# EAGLE board memory_mkII (EAGLE 9.5.2), part 1 of 2
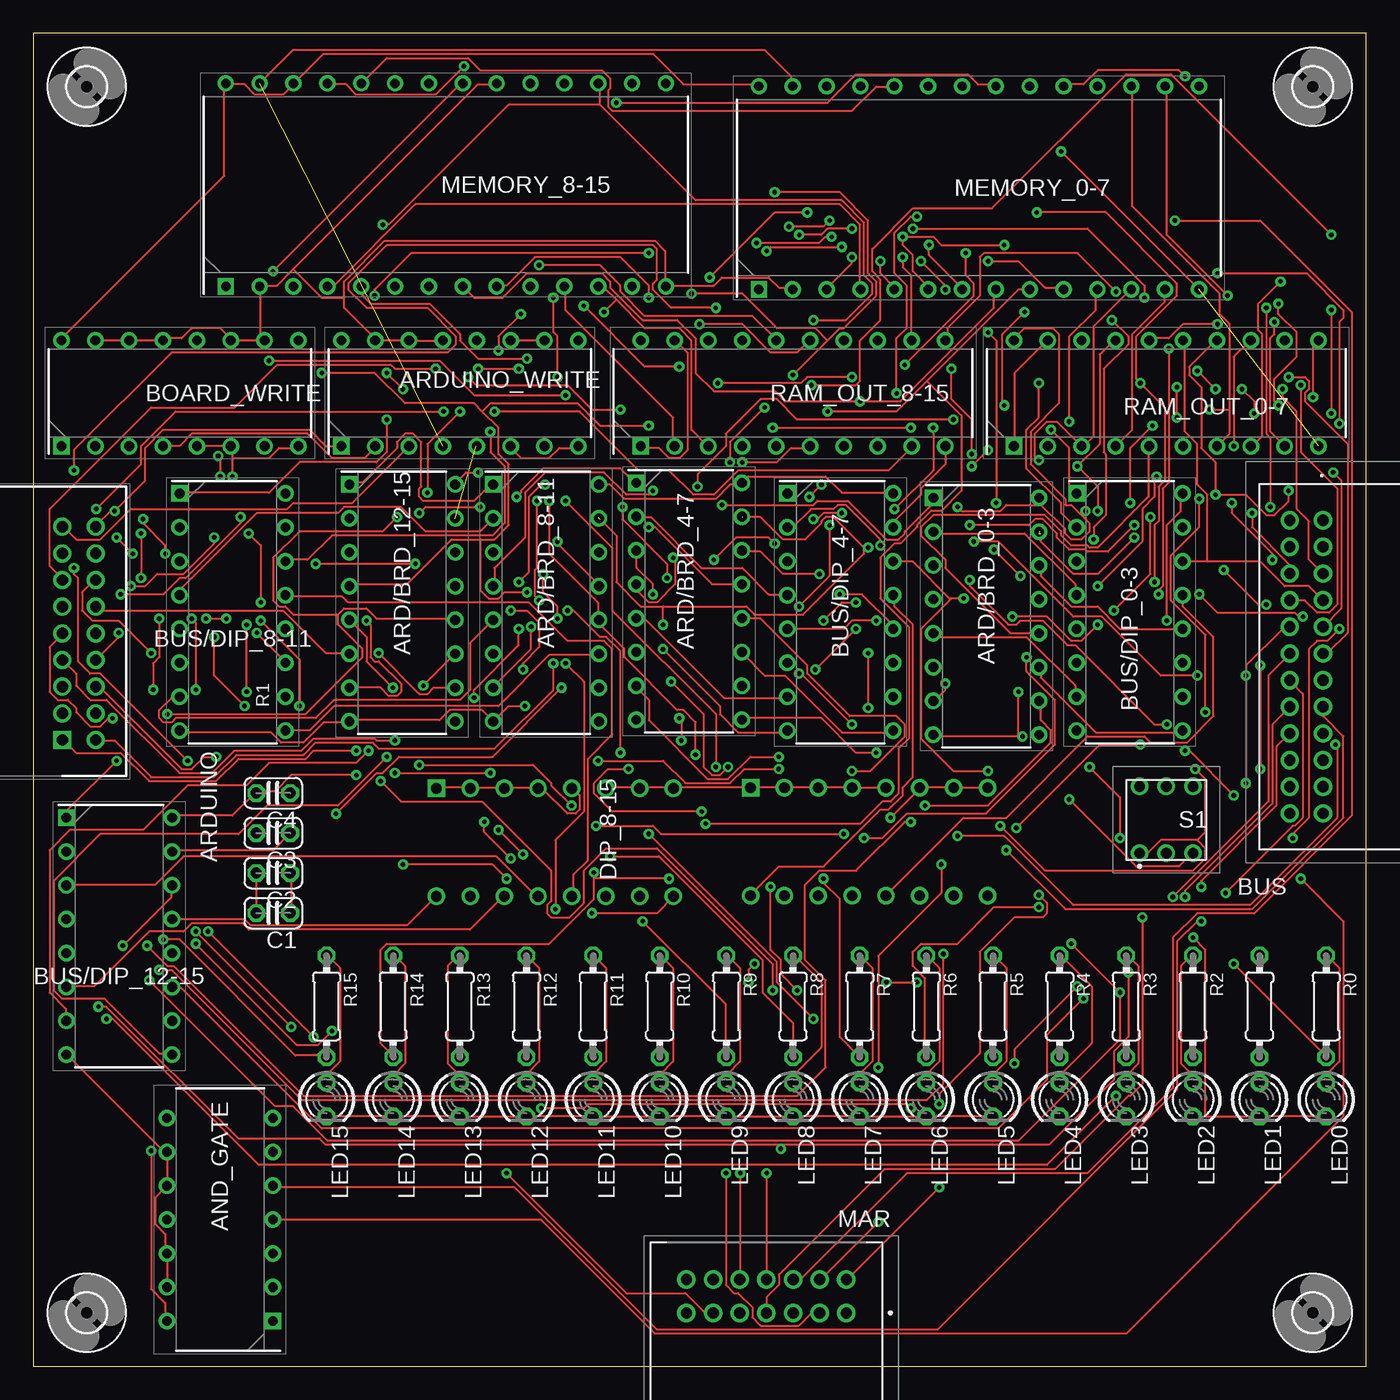
[diagram p1: board, top side]
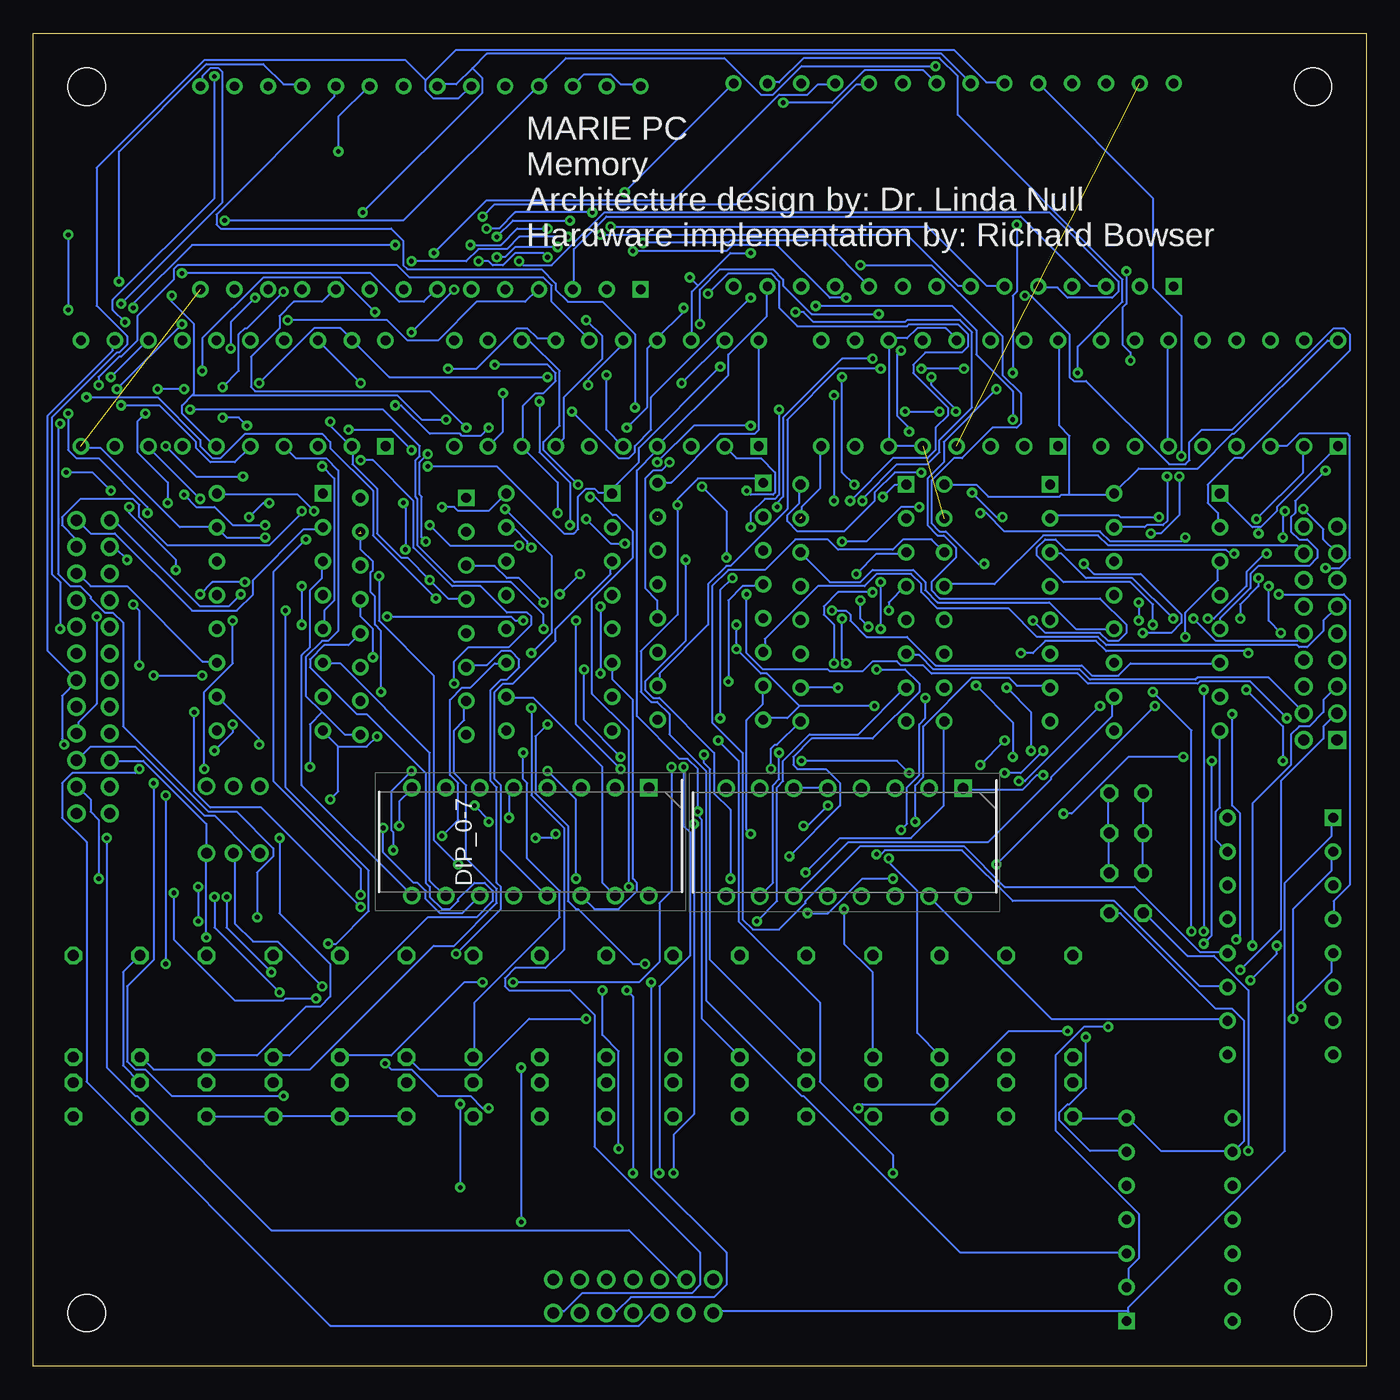
[diagram p2: board, bottom side, seen from below]

Size 100 x 100 mm. Coordinates in mm from the lower left corner, seen from the top.
Outline: 0,0 100,0 100,100 0,100 0,0
Copper layers (1*16): Top 0.035mm / dielectric 1.5mm / Bottom 0.035mm
Design rules "default": minimum track width 6mil, minimum drill 0.35mm, track to track 6mil, track to pad 6mil, pad to pad 6mil, via to via 6mil, smd to smd 6mil, copper to edge 40mil, drill to drill 6mil, minimum pad ring 10mil, minimum via ring 8mil, stop-mask expansion 4mil, vias tented up to drill 0mil, thermal gap 10mil

## Footprints (pad centres in the part's own frame; a part is rotated, then mirrored left to right if it is on the bottom)
DIP794W53P254L1930H508Q14N = drill 0.73 pad 1.13 square: 1 -3.97,7.62 | drill 0.73 pad 1.13: 2 -3.97,5.08; 3 -3.97,2.54; 4 -3.97,0; 5 -3.97,-2.54; 6 -3.97,-5.08; 7 -3.97,-7.62; 8 3.97,-7.62; 9 3.97,-5.08; 10 3.97,-2.54; 11 3.97,0; 12 3.97,2.54; 13 3.97,5.08; 14 3.97,7.62
DIP794W53P254L1930H508Q16N = drill 0.73 pad 1.13 square: 1 -3.97,8.89 | drill 0.73 pad 1.13: 2 -3.97,6.35; 3 -3.97,3.81; 4 -3.97,1.27; 5 -3.97,-1.27; 6 -3.97,-3.81; 7 -3.97,-6.35; 8 -3.97,-8.89; 9 3.97,-8.89; 10 3.97,-6.35; 11 3.97,-3.81; 12 3.97,-1.27; 13 3.97,1.27; 14 3.97,3.81; 15 3.97,6.35; 16 3.97,8.89
SHDR18W65P250X200_2X9_2140X140 = drill 0.85 pad 1.275 square: 1 0,0 | drill 0.85 pad 1.275: 2 0,-2.5; 3 2,0; 4 2,-2.5; 5 4,0; 6 4,-2.5; 7 6,0; 8 6,-2.5; 9 8,0; 10 8,-2.5; 11 10,0; 12 10,-2.5; 13 12,0; 14 12,-2.5; 15 14,0; 16 14,-2.5; 17 16,0; 18 16,-2.5
559592430 = drill 0.85 pad 1.381: 1 0,0; 2 0,-2.5; 3 2,0; 4 2,-2.5; 5 4,0; 6 4,-2.5; 7 6,0; 8 6,-2.5; 9 8,0; 10 8,-2.5; 11 10,0; 12 10,-2.5; 13 12,0; 14 12,-2.5; 15 14,0; 16 14,-2.5; 17 16,0; 18 16,-2.5; 19 18,0; 20 18,-2.5; 21 20,0; 22 20,-2.5; 23 22,0; 24 22,-2.5
C025-024X044 = drill 0.813 octagon: 1 -1.27,0; 2 1.27,0
DIP810W60P254L2225H590Q16N = drill 0.8 pad 1.2 square: 1 -4.05,8.89 | drill 0.8 pad 1.2: 2 -4.05,6.35; 3 -4.05,3.81; 4 -4.05,1.27; 5 -4.05,-1.27; 6 -4.05,-3.81; 7 -4.05,-6.35; 8 -4.05,-8.89; 9 4.05,-8.89; 10 4.05,-6.35; 11 4.05,-3.81; 12 4.05,-1.27; 13 4.05,1.27; 14 4.05,3.81; 15 4.05,6.35; 16 4.05,8.89
LED3MM = drill 0.813 octagon: A -1.27,0; K 1.27,0
559591430 = drill 0.85 pad 1.381: 1 0,0; 2 2,0; 3 4,0; 4 6,0; 5 8,0; 6 10,0; 7 12,0; 8 0,-2.5; 9 2,-2.5; 10 4,-2.5; 11 6,-2.5; 12 8,-2.5; 13 10,-2.5; 14 12,-2.5
DIP1524W51P254L3632H394Q28N = drill 0.708 pad 1.108 square: 1 -7.62,16.51 | drill 0.708 pad 1.108: 2 -7.62,13.97; 3 -7.62,11.43; 4 -7.62,8.89; 5 -7.62,6.35; 6 -7.62,3.81; 7 -7.62,1.27; 8 -7.62,-1.27; 9 -7.62,-3.81; 10 -7.62,-6.35; 11 -7.62,-8.89; 12 -7.62,-11.43; 13 -7.62,-13.97; 14 -7.62,-16.51; 15 7.62,-16.51; 16 7.62,-13.97; 17 7.62,-11.43; 18 7.62,-8.89; 19 7.62,-6.35; 20 7.62,-3.81; 21 7.62,-1.27; 22 7.62,1.27; 23 7.62,3.81; 24 7.62,6.35; 25 7.62,8.89; 26 7.62,11.43; 27 7.62,13.97; 28 7.62,16.51
0204/7 = drill 0.813 octagon: 1 -3.81,0; 2 3.81,0
DIP794W53P254L2540H508Q20N = drill 0.73 pad 1.13 square: 1 -3.97,11.43 | drill 0.73 pad 1.13: 2 -3.97,8.89; 3 -3.97,6.35; 4 -3.97,3.81; 5 -3.97,1.27; 6 -3.97,-1.27; 7 -3.97,-3.81; 8 -3.97,-6.35; 9 -3.97,-8.89; 10 -3.97,-11.43; 11 3.97,-11.43; 12 3.97,-8.89; 13 3.97,-6.35; 14 3.97,-3.81; 15 3.97,-1.27; 16 3.97,1.27; 17 3.97,3.81; 18 3.97,6.35; 19 3.97,8.89; 20 3.97,11.43
MHPS2273N = drill 0.8 pad 1.3: A1 -2,-2.5; A2 0,-2.5; A3 2,-2.5; B1 -2,2.5; B2 0,2.5; B3 2,2.5
2,8 = hole 2.8: 0,0

## Placement (x,y rotation side)
AND_GATE  SN74HC08N  [DIP794W53P254L1930H508Q14N]  14,11 180 top
ARD/BRD_0-3  SN74HC157N  [DIP794W53P254L1930H508Q16N]  71.5,56.26 0 top
ARD/BRD_4-7  SN74HC157N  [DIP794W53P254L1930H508Q16N]  49.2,57.39 0 top
ARD/BRD_8-11  SN74HC157N  [DIP794W53P254L1930H508Q16N]  38.47,57.26 0 top
ARD/BRD_12-15  SN74HC157N  [DIP794W53P254L1930H508Q16N]  27.68,57.26 0 top
ARDUINO  55959-1830  [SHDR18W65P250X200_2X9_2140X140]  2.18,46.98 90 top
ARDUINO_WRITE  SN74HC157N  [DIP794W53P254L1930H508Q16N]  32,73 90 top
BOARD_WRITE  SN74HC157N  [DIP794W53P254L1930H508Q16N]  11,73 90 top
BUS  55959-2430  [559592430]  96.77,63.47 270 top
BUS/DIP_0-3  SN74HC157N  [DIP794W53P254L1930H508Q16N]  82.25,56.58 0 top
BUS/DIP_4-7  SN74HC157N  [DIP794W53P254L1930H508Q16N]  60.55,56.58 0 top
BUS/DIP_8-11  SN74HC157N  [DIP794W53P254L1930H508Q16N]  14.95,56.58 0 top
BUS/DIP_12-15  SN74HC157N  [DIP794W53P254L1930H508Q16N]  6.44,32.26 0 top
C1  [C025-024X044]  18,34 180 top
C2  [C025-024X044]  18,37 180 top
C3  [C025-024X044]  18,40 180 top
C4  [C025-024X044]  18,43 180 top
DIP_0-7  ADE08A04  [DIP810W60P254L2225H590Q16N]  62.7,39.34 270 bottom
DIP_8-15  ADE08A04  [DIP810W60P254L2225H590Q16N]  39.14,39.3 270 bottom
LED0  RED  [LED3MM]  97,20 270 top
LED1  RED  [LED3MM]  92,20 270 top
LED2  RED  [LED3MM]  87,20 270 top
LED3  RED  [LED3MM]  82,20 270 top
LED4  RED  [LED3MM]  77,20 270 top
LED5  RED  [LED3MM]  72,20 270 top
LED6  RED  [LED3MM]  67,20 270 top
LED7  RED  [LED3MM]  62,20 270 top
LED8  RED  [LED3MM]  57,20 270 top
LED9  RED  [LED3MM]  52,20 270 top
LED10  RED  [LED3MM]  47,20 270 top
LED11  RED  [LED3MM]  42,20 270 top
LED12  RED  [LED3MM]  37,20 270 top
LED13  RED  [LED3MM]  32,20 270 top
LED14  RED  [LED3MM]  27,20 270 top
LED15  RED  [LED3MM]  22,20 270 top
MAR  55959-1430  [559591430]  61,4 180 top
MEMORY_0-7  AS6C6264-55PIN  [DIP1524W51P254L3632H394Q28N]  70.95,88.41 90 top
MEMORY_8-15  AS6C6264-55PIN  [DIP1524W51P254L3632H394Q28N]  30.95,88.63 90 top
R0  220  [0204/7]  97,27 270 top
R1  220  [0204/7]  92,27 270 top
R2  220  [0204/7]  87,27 270 top
R3  220  [0204/7]  82,27 270 top
R4  220  [0204/7]  77,27 270 top
R5  220  [0204/7]  72,27 270 top
R6  220  [0204/7]  67,27 270 top
R7  220  [0204/7]  62,27 270 top
R8  220  [0204/7]  57,27 270 top
R9  220  [0204/7]  52,27 270 top
R10  220  [0204/7]  47,27 270 top
R11  220  [0204/7]  42,27 270 top
R12  220  [0204/7]  37,27 270 top
R13  220  [0204/7]  32,27 270 top
R14  220  [0204/7]  27,27 270 top
R15  220  [0204/7]  22,27 270 top
RAM_OUT_0-7  SN74HC541N  [DIP794W53P254L2540H508Q20N]  85,73 90 top
RAM_OUT_8-15  SN74HC541N  [DIP794W53P254L2540H508Q20N]  57,73 90 top
S1  MHPS2273N  [MHPS2273N]  85,41 0 top
U$1  [2,8]  4,96 0 top
U$2  [2,8]  96,96 0 top
U$3  [2,8]  96,4 0 top
U$4  [2,8]  4,4 0 top

## Tracks (layer width: path | path; a pad name or v marks a point on that pad's centre or on a via)
A0  (via drill 0.35)
  Top 0.152: v71.63,82.91 73.91,82.91 75.89,80.92 77.27,80.92 MEMORY_0-7.10 | v59.89,84.73 59.44,84.73 58.98,84.28 v54.25,84.28 | v62.64,53.49 v62.64,49.38 | v64.62,64.31 67.51,67.21 v67.51,70.41
  Bottom 0.152: v71.63,82.91 67.51,82.91 66.6,83.82 64.47,83.82 63.55,84.73 v59.89,84.73 | v54.25,84.28 47.85,84.28 47.7,84.43 40.69,84.43 37.34,81.08 MEMORY_8-15.10 | v62.64,49.38 62.64,42.82 60.2,40.39 60.2,31.24 61.57,29.87 63.86,29.87 64.62,29.11 64.62,28.5 64.31,28.19 59.74,28.19 57.91,26.36 57.91,16.46 49.99,8.53 49.99,6.1 50.6,5.49 58.83,5.49 60.2,4.12 60.96,4.12 MAR.1 | v62.64,53.49 61.11,55.02 61.11,60.81 v64.62,64.31 | v67.51,70.41 70.26,73.15 83.36,73.15 83.67,73.46 83.67,75.74 81.53,77.88 81.53,78.79 80.47,79.86 78.33,79.86 77.42,80.77 MEMORY_0-7.10
A1  (via drill 0.35)
  Top 0.152: v46.18,80.16 46.18,81.08 44.04,83.21 37.64,83.21 35.51,81.08 34.9,81.08 MEMORY_8-15.9 | v59.59,71.63 64.77,71.63 67.06,73.91 | 67.06,73.91 73.91,80.77 74.68,80.77 MEMORY_0-7.9 | v51.97,14.48 51.97,6.1 52.58,5.49 52.88,5.49 53.95,4.42 53.95,3.66 54.56,3.05 57.45,3.05 58.37,3.96 58.98,3.96 MAR.2 | v50.44,40.69 62.03,40.69 63.7,42.37 64.31,42.37 64.92,42.98 64.92,46.33 65.68,47.09 65.68,55.47 63.55,57.61 63.55,60.66 64.62,61.72 65.08,61.72 66.29,62.94 66.29,63.09 67.36,64.16 68.12,64.16 69.65,65.68 69.65,71.32 67.06,73.91
  Bottom 0.152: v46.18,80.16 53.65,72.69 53.65,70.26 54.86,69.04 54.86,68.58 55.32,68.12 56.08,68.12 v59.59,71.63 | v51.97,14.48 51.97,17.37 50.44,18.9 v50.44,40.69
A2  (via drill 0.35)
  Top 0.152: MEMORY_0-7.8 72.08,80.77 72.08,79.4 65.08,72.39 v62.03,72.39 56.39,72.39 55.63,73.15 51.05,73.15 49.68,74.52 49.68,77.11 48.31,78.49 45.72,78.49 43.28,80.92 43.28,81.38 42.67,81.99 37.03,81.99 35.2,80.16 33.07,80.16 32.31,80.92 MEMORY_8-15.8 | v53.65,28.8 53.65,29.72 v54.1,30.18 | v61.42,48.16 57.61,51.97 v57.45,51.97 | v57.45,57 59.74,59.28 v59.74,63.09
  Bottom 0.152: v53.65,28.8 53.65,14.17 48.01,8.53 48.01,6.1 48.92,5.18 55.17,5.18 56.24,4.12 57,4.12 MAR.3 | v54.1,30.18 55.02,30.18 59.13,34.29 59.28,34.29 59.89,34.9 59.89,40.54 62.33,42.98 62.33,47.24 v61.42,48.16 | v57.45,57 v57.45,51.97 | v59.74,63.09 59.74,66.29 62.03,68.58 v62.03,72.39
A3  (via drill 0.35)
  Top 0.152: v57.45,84.89 59.13,84.89 59.59,85.34 v61.42,85.34 | v67.21,84.12 67.21,83.36 69.65,80.92 MEMORY_0-7.7 | v83.21,33.68 83.21,21.18 82.3,20.27 82.14,20.27 76.66,14.78 63.86,14.78 55.93,6.86 55.93,6.1 55.02,5.18 55.02,4.12 MAR.4 | v97.99,70.71 97.99,78.33 98.3,78.64 98.3,79.25 95.56,81.99 v88.85,81.99
  Bottom 0.152: v57.45,84.89 34.44,84.89 30.63,81.08 29.72,81.08 MEMORY_8-15.7 | v61.42,85.34 63.7,85.34 64.92,84.12 v67.21,84.12 | v83.21,33.68 83.21,37.03 81.99,38.25 81.99,38.86 84.73,41.6 86.87,41.6 93.27,48.01 93.27,55.78 94.03,56.54 94.64,56.54 95.71,57.61 95.71,57.76 96.47,58.52 97.23,58.52 98.15,59.44 98.15,70.56 v97.99,70.71 | v88.85,81.99 74.68,81.99 72.54,79.86 70.71,79.86 69.8,80.77 MEMORY_0-7.7
A4  (via drill 0.35)
  Top 0.152: v56.69,85.5 59.28,85.5 v59.74,85.95 | MEMORY_0-7.6 67.21,80.92 65.99,82.14 65.99,83.36 65.23,84.12 v65.23,84.73 67.51,84.73 68.12,84.12 v72.85,84.12 | v92.05,52.58 v92.05,44.81 | v92.51,57.15 91.9,57.15 v89.31,59.74 | v92.81,64.47 92.81,69.65 92.51,69.95 v92.51,79.4
  Bottom 0.152: v56.69,85.5 32.92,85.5 28.5,81.08 27.28,81.08 MEMORY_8-15.6 | v59.74,85.95 64.01,85.95 v65.23,84.73 | v92.05,44.81 92.35,44.5 97.08,44.5 97.84,43.74 97.84,41.15 96.01,39.32 96.01,21.34 77.72,3.05 54.56,3.05 53.65,3.96 53.03,3.96 MAR.5 | v92.05,52.58 92.05,56.69 v92.51,57.15 | v89.31,59.74 89.31,60.5 92.81,64.01 v92.81,64.47 | v92.51,79.4 92.51,79.7 88.09,84.12 v72.85,84.12
A5  (via drill 0.35)
  Top 0.152: v63.55,82.91 63.55,81.99 64.62,80.92 MEMORY_0-7.5 | v35.51,14.48 44.5,5.49 48.92,5.49 50.29,4.12 50.9,4.12 MAR.6 | v48.62,46.94 48.62,48.46 v48.46,48.62 | v47.55,59.13 47.55,60.2 44.2,63.55 v44.2,64.47 | v37.03,75.59 33.38,75.59 32,76.96 32,77.42 29.72,79.7 25.3,79.7 24.69,80.31 24.69,80.92 MEMORY_8-15.5
  Bottom 0.152: v63.55,82.91 63.25,82.6 61.11,82.6 57.15,86.56 23.77,86.56 18.59,81.38 18.59,80.62 19.05,80.16 22.4,80.16 23.16,80.92 24.54,80.92 MEMORY_8-15.5 | v35.51,14.48 35.51,15.85 41,21.34 41,27.28 47.09,33.38 47.09,45.41 v48.62,46.94 | v48.46,48.62 48.46,58.22 v47.55,59.13 | v44.2,64.47 44.2,64.77 43.74,65.23 43.74,71.17 39.32,75.59 v37.03,75.59
A6  (via drill 0.35)
  Top 0.152: MEMORY_8-15.4 22.1,81.08 22.55,81.08 28.65,87.17 60.5,87.17 62.03,85.65 62.03,80.92 MEMORY_0-7.4 | v67.97,13.41 61.11,6.55 MAR.8 | v67.97,19.66 67.97,20.42 71.02,23.47 71.02,31.09 73.61,33.68 75.74,33.68 76.05,33.98 76.05,34.75 v75.44,35.36 | v79.55,62.03 79.55,62.94 80.47,63.86 80.47,68.43 80.31,68.58 80.31,74.83 82.14,76.66 82.14,77.27 v80.92,78.49
  Bottom 0.152: v67.97,19.66 v67.97,13.41 | v75.44,35.36 75.44,37.34 81.99,43.89 81.99,59.59 v79.55,62.03 | v80.92,78.49 73.46,78.49 71.93,76.96 69.65,76.96 66.75,79.86 63.09,79.86 62.18,80.77 MEMORY_0-7.4
A7  (via drill 0.35)
  Top 0.152: v63.4,10.82 59.13,6.55 MAR.9 | v63.4,22.4 63.4,30.79 68.12,35.51 v68.12,37.64 | v72.08,61.27 v74.07,59.28 | v72.24,64.77 72.24,76.96 v71.63,77.57 | v68.43,80.77 68.43,81.08 v66.6,82.91 | v61.42,83.21 61.42,82.75 59.59,80.92 MEMORY_0-7.3
  Bottom 0.152: MEMORY_8-15.3 19.66,81.08 20.73,81.08 25.91,86.26 57,86.26 59.44,83.82 59.44,80.92 MEMORY_0-7.3 | v63.4,22.4 v63.4,10.82 | v68.12,37.64 69.95,39.47 69.95,51.82 74.07,55.93 v74.07,59.28 | v72.08,61.27 72.08,64.62 v72.24,64.77 | v68.43,80.77 v71.63,77.57 | v66.6,82.91 65.84,82.91 65.53,82.6 64.77,82.6 63.86,83.52 61.72,83.52 v61.42,83.21
A8  (via drill 0.35)
  Top 0.152: v32.31,97.54 30.18,95.4 24.23,95.4 23.47,96.16 22.1,96.16 MEMORY_8-15.25 | v85.65,85.95 92.05,85.95 98.91,79.1 98.91,41.3 91.59,33.98 87.33,33.98 85.5,32.16 85.5,20.88 79.1,14.48 65.53,14.48 57.61,6.55 57.15,6.55 MAR.10
  Bottom 0.152: v32.31,97.54 42.37,97.54 44.5,95.4 45.41,95.4 48.16,98.15 60.05,98.15 62.03,96.16 MEMORY_0-7.25 62.18,96.01 72.24,85.95 v85.65,85.95
A9  (via drill 0.35)
  Top 0.152: MEMORY_0-7.24 64.47,96.01 63.25,96.01 61.42,94.18 43.43,94.18 43.13,94.49 43.13,95.71 43.28,95.86 43.28,96.62 42.67,97.23 33.53,97.23 32.61,98.15 26.52,98.15 24.69,96.32 MEMORY_8-15.24 | v55.02,14.48 55.02,6.55 MAR.11 | v55.47,28.19 55.47,30.18 46.79,38.86 42.98,38.86 41.3,37.19 41.3,34.75 40.23,33.68 38.86,33.68 38.56,33.98 38.56,34.59 38.86,34.9 38.86,37.19 33.68,42.37 27.58,42.37 v26.06,43.89 | v19.96,49.53 19.96,53.03 v17.07,55.93 | v17.07,57.3 17.07,61.57 v16.15,62.48 | v14.02,66.75 14.02,68.12 v13.87,68.28
  Bottom 0.152: v55.02,14.48 55.02,27.74 v55.47,28.19 | v26.06,43.89 25.6,43.89 v19.96,49.53 | v17.07,57.3 v17.07,55.93 | v16.15,62.48 15.39,62.48 14.02,63.86 v14.02,66.75 | v13.87,68.28 13.87,78.79 16,80.92 16,87.63 24.54,96.16 MEMORY_8-15.24
A10  (via drill 0.35)
  Top 0.152: v43.74,94.79 59.59,94.79 61.72,96.93 70.1,96.93 70.87,96.16 72.08,96.16 MEMORY_0-7.21 | v53.03,14.48 53.03,6.55 MAR.12 | v51.21,44.96 51.21,48.92 43.43,56.69 43.43,61.42 v39.93,64.92 | v39.93,72.85 33.07,72.85 30.48,75.44 v17.68,75.44 | v17.98,82.14 32.16,96.32 MEMORY_8-15.21
  Bottom 0.152: v43.74,94.79 40.08,94.79 37.64,97.23 33.22,97.23 32.31,96.32 MEMORY_8-15.21 | v53.03,14.48 53.03,28.5 50.75,30.79 50.75,40.08 51.21,40.54 v51.21,44.96 | v39.93,72.85 v39.93,64.92 | v17.68,75.44 17.68,76.05 18.29,76.66 18.29,79.4 17.98,79.7 v17.98,82.14
A11  (via drill 0.35)
  Top 0.152: v94.49,39.62 94.49,39.93 95.71,41.15 95.71,53.8 96.32,54.41 97.08,54.41 v97.99,55.32
  Bottom 0.152: 70.56,96.47 68.28,98.75 30.94,98.75 28.5,96.32 27.28,96.32 MEMORY_8-15.23 | 70.56,96.47 70.56,95.71 69.95,95.1 68.12,95.1 67.21,96.01 MEMORY_0-7.23 | v94.49,39.62 94.49,22.4 92.35,20.27 92.2,20.27 82.14,10.21 55.32,10.21 51.66,6.55 51.05,6.55 MAR.13 | v97.99,55.32 97.99,58.83 98.6,59.44 98.6,71.17 93.73,76.05 93.57,76.05 92.96,76.66 92.96,77.27 95.25,79.55 95.25,89.92 87.17,97.99 72.08,97.99 70.56,96.47
ARD0  (via drill 0.35)
  Top 0.152: v61.72,57.3 60.66,57.3 v59.28,55.93 | v55.93,44.81 53.34,44.81 52.27,43.74 48.92,43.74 47.24,45.41 v42.37,45.41 | v27.13,44.5 v34.29,44.5 | v24.23,46.18 21.03,46.18 20.42,45.57 15.39,45.57 13.72,43.89 8.69,43.89 6.55,46.02 3.2,46.02 2.29,46.94 ARDUINO.1
  Bottom 0.152: v61.72,57.3 63.55,59.13 64.47,59.13 65.38,60.05 67.51,60.05 ARD/BRD_0-3.3 | v59.28,55.93 59.28,48.16 v55.93,44.81 | v42.37,45.41 35.2,45.41 v34.29,44.5 | v27.13,44.5 25.91,44.5 v24.23,46.18
ARD1  (via drill 0.35)
  Top 0.152: v68.28,30.94 68.28,21.18 67.06,19.96 20.12,19.96 10.36,29.72 v9.45,29.72
  Bottom 0.152: v68.28,30.94 64.92,34.29 64.92,35.97 65.23,36.27 65.23,43.43 65.68,43.89 65.68,50.75 64.92,51.51 64.47,51.51 63.55,52.43 63.55,53.03 64.16,53.65 64.92,53.65 65.99,52.58 67.51,52.58 ARD/BRD_0-3.6 | v9.45,29.72 6.4,32.77 6.4,43.89 3.2,47.09 3.2,48.01 2.29,48.92 ARDUINO.3
ARD2  (via drill 0.35)
  Top 0.152: v66.9,42.06 71.63,42.06 76.35,46.79 76.35,47.7 75.59,48.46 75.59,49.84 ARD/BRD_0-3.10 | v65.84,40.84 65.38,40.84 61.72,37.19 58.98,37.19 57.91,36.12 57.91,30.48 59.44,28.96 59.44,22.4 57.3,20.27 20.27,20.27 10.52,30.02 10.06,30.02 v8.53,31.55
  Bottom 0.152: v66.9,42.06 65.84,41 v65.84,40.84 | v8.53,31.55 8.53,42.22 5.64,45.11 5.64,47.4 5.03,48.01 4.27,48.01 3.2,49.07 3.2,49.99 2.29,50.9 ARDUINO.5
ARD3  (via drill 0.35)
  Top 0.152: v74.52,53.19 74.52,52.12 76.66,49.99 76.66,46.63 71.48,41.45 65.53,41.45 63.7,39.62 v62.33,39.62 | v60.81,39.93 47.09,39.93 46.48,40.54 v42.22,40.54 | v40.39,42.06 38.86,43.59 38.86,43.74 37.49,45.11 v28.96,45.11 | v27.13,46.94 25.76,46.94 25.6,47.09 21.03,47.09 20.12,46.18 15.09,46.18 13.41,44.5 10.97,44.5 5.49,49.99 4.27,49.99 3.2,51.05 3.2,51.97 2.29,52.88 ARDUINO.7
  Bottom 0.152: v74.52,53.19 74.52,55.32 75.44,56.24 75.44,57.45 ARD/BRD_0-3.13 | v62.33,39.62 61.11,39.62 v60.81,39.93 | v42.22,40.54 41.91,40.54 v40.39,42.06 | v27.13,46.94 v28.96,45.11
ARD4  (via drill 0.35)
  Top 0.152: v46.48,57.91 46.48,58.67 45.26,59.89 45.26,61.11 ARD/BRD_4-7.3 | v5.94,48.62 5.64,48.62 5.03,48.01 4.27,48.01 3.2,49.07 3.2,49.38 2.59,49.99 1.83,49.99 1.22,50.6 1.22,53.95 2.13,54.86 ARDUINO.9
  Bottom 0.152: v46.48,57.91 46.48,53.49 45.26,52.27 40.39,52.27 40.23,52.12 37.8,52.12 37.03,52.88 35.2,52.88 34.9,52.58 33.22,52.58 32.61,51.97 21.64,51.97 20.88,51.21 12.65,51.21 12.5,51.36 8.69,51.36 v5.94,48.62
ARD5
  Bottom 0.152: ARD/BRD_4-7.6 45.11,53.65 45.11,54.56 41.15,58.52 37.64,58.52 36.73,59.44 34.14,59.44 33.38,58.67 33.38,58.06 32.16,56.84 26.82,56.84 24.69,54.71 20.12,54.71 19.51,54.1 5.18,54.1 5.03,53.95 4.42,53.95 3.2,55.17 3.2,55.93 2.29,56.84 ARDUINO.11
ARD6  (via drill 0.35)
  Top 0.152: v33.38,74.83 v36.42,74.83 | v30.18,74.83 27.13,74.83 26.82,75.13 18.29,75.13 15.09,71.93 8.84,71.93 1.22,64.31 1.22,60.05 2.13,59.13 ARDUINO.13
  Bottom 0.152: v36.42,74.83 39.62,74.83 43.43,71.02 43.43,64.31 47.7,60.05 48.01,60.05 49.38,58.67 49.38,55.63 53.03,51.97 53.03,51.05 ARD/BRD_4-7.10 | v30.18,74.83 v33.38,74.83
ARD7  (via drill 0.35)
  Top 0.152: v46.18,62.94 46.63,62.94 50.9,58.67 53.03,58.67 ARD/BRD_4-7.13 | v44.04,71.78 41.91,71.78 40.08,73.61 33.22,73.61 v32.61,74.22 | v30.79,71.63 10.67,71.63 8.08,69.04 8.08,67.67 v4.72,64.31
  Bottom 0.152: v46.18,62.94 46.18,64.01 45.11,65.08 44.35,65.08 44.04,65.38 v44.04,71.78 | v32.61,74.22 32.61,73.61 30.79,71.78 v30.79,71.63 | v4.72,64.31 3.2,62.79 3.2,62.03 2.29,61.11 ARDUINO.15
ARD8  (via drill 0.35)
  Top 0.152: v38.25,59.44 38.25,58.06 39.32,57 v39.32,56.08 | v39.01,52.73 39.01,50.75 34.59,46.33 25.91,46.33 25.45,46.79 21.18,46.79 20.27,45.87 15.24,45.87 13.56,44.2 8.84,44.2 6.1,46.94 4.72,46.94 ARDUINO.2
  Bottom 0.152: v38.25,59.44 36.73,60.96 34.59,60.96 ARD/BRD_8-11.3 | v39.32,56.08 39.32,53.03 v39.01,52.73
ARD9
  Bottom 0.152: ARD/BRD_8-11.6 34.44,53.34 33.53,53.34 32.46,52.27 21.49,52.27 20.73,51.51 12.8,51.51 12.65,51.66 7.32,51.66 4.72,49.07 ARDUINO.4
ARD10  (via drill 0.35)
  Top 0.152: v39.62,50.9 34.44,45.72 27.43,45.72 26.21,44.5 25.76,44.5 v22.71,41.45 | v13.72,45.72 12.8,45.72 11.89,44.81 11.12,44.81 5.03,50.9 4.72,50.9 ARDUINO.6
  Bottom 0.152: v39.62,50.9 42.37,50.9 ARD/BRD_8-11.10 | v22.71,41.45 22.1,41.45 17.83,45.72 v13.72,45.72
ARD11  (via drill 0.35)
  Top 0.152: v39.32,61.87 39.32,61.72 42.37,58.67 ARD/BRD_8-11.13 | v33.53,64.47 29.41,64.47 v28.96,64.01 | v13.56,62.18 13.56,61.72 11.28,59.44 9.3,59.44 8.38,58.52 v7.32,58.52 | v6.4,55.02 6.4,54.71 4.72,53.03 ARDUINO.8
  Bottom 0.152: v39.32,61.87 37.49,61.87 34.9,64.47 v33.53,64.47 | v28.96,64.01 28.5,64.01 27.13,62.64 19.96,62.64 19.2,61.87 13.87,61.87 v13.56,62.18 | v7.32,58.52 7.32,55.93 v6.4,55.02
ARD12  (via drill 0.35)
  Top 0.152: v12.95,56.08 v14.48,56.08
  Bottom 0.152: v14.48,56.08 17.53,59.13 21.03,59.13 22.86,60.96 23.62,60.96 ARD/BRD_12-15.3 | v12.95,56.08 11.28,54.41 5.18,54.41 4.72,54.86 ARDUINO.10
ARD13
  Top 0.152: ARD/BRD_12-15.6 23.62,53.49 21.95,53.49 18.75,56.69 4.88,56.69 4.72,56.84 ARDUINO.12
ARD14  (via drill 0.35)
  Top 0.152: v25.91,53.49 28.96,50.44 29.57,50.44 30.02,50.9 31.55,50.9 ARD/BRD_12-15.10 | v8.84,53.49 6.4,55.93 4.42,55.93 3.66,56.69 3.66,58.06 4.57,58.98 ARDUINO.14
  Bottom 0.152: v25.91,53.49 24.99,53.49 24.08,54.41 20.27,54.41 19.51,53.65 8.99,53.65 v8.84,53.49
ARD15
  Bottom 0.152: ARD/BRD_12-15.13 31.55,58.67 27.89,58.67 24.23,62.33 20.12,62.33 19.36,61.57 5.18,61.57 4.72,61.11 ARDUINO.16
ARDPRGM  (via drill 0.35)
  Top 0.152: v12.19,32.61 v19.36,25.45 | v12.19,50.75 12.19,55.78 v11.89,56.08 | v6.25,62.18 v7.47,60.96 | ARDUINO.18 4.72,63.09 5.79,64.16 v6.1,64.16 8.38,66.45 8.38,68.89 9.75,70.26 20.73,70.26 21.95,69.04 23.01,69.04 ARDUINO_WRITE.1
  Bottom 0.152: v19.36,25.45 21.18,25.45 23.32,23.32 23.32,17.68 17.07,11.43 17.07,8.08 17.83,7.32 17.83,5.94 AND_GATE.2 | v12.19,50.75 v12.19,32.61 | v11.89,56.08 11.43,56.08 8.99,58.52 8.99,59.59 7.62,60.96 v7.47,60.96 | v6.25,62.18 6.25,64.01 v6.1,64.16
ARDWRITE
  Top 0.152: ARDUINO_WRITE.3 28.04,68.89 23.93,64.77 19.51,64.77 19.05,64.31 7.32,64.31 5.03,62.03 3.2,62.03 2.29,62.94 ARDUINO.17
B0  (via drill 0.35)
  Top 0.152: v75.44,73.76 75.44,71.17 74.52,70.26 74.52,67.36 77.11,64.77 77.11,64.01 78.18,62.94 BUS/DIP_0-3.2
  Bottom 0.152: BUS/DIP_0-3.2 78.33,62.79 79.7,62.79 83.52,58.98 83.52,57.91 84.73,56.69 88.09,56.69 93.88,62.48 95.71,62.48 96.62,63.4 BUS.1 | v75.44,73.76 78.64,76.96 RAM_OUT_0-7.18
B1  (via drill 0.35)
  Top 0.152: RAM_OUT_0-7.17 81.08,76.96 80.01,75.89 80.01,69.19 v78.33,67.51 79.86,65.99 v79.86,64.16
  Bottom 0.152: v78.33,67.51 77.42,66.6 77.42,57.45 78.18,56.69 78.18,55.32 BUS/DIP_0-3.5 | v79.86,64.16 79.86,64.01 82.3,61.57 89.92,61.57 92.05,63.7 92.05,64.62 92.51,65.08 96.47,65.08 97.84,63.7 97.84,63.09 96.77,62.03 96.77,61.57 BUS.3
B2  (via drill 0.35)
  Top 0.152: v88.85,78.18 86.26,78.18 85.19,77.11 83.82,77.11 RAM_OUT_0-7.16 | v93.73,73.3 93.73,72.69 94.79,71.63 94.79,64.31 95.71,63.4 95.71,60.5 96.62,59.59 BUS.5
  Bottom 0.152: BUS/DIP_0-3.11 86.26,52.88 87.33,52.88 92.96,58.52 95.71,58.52 96.62,59.44 BUS.5 | v93.73,73.3 v88.85,78.18
B3
  Top 0.152: 88.09,60.35 92.05,60.35 93.88,58.52 95.71,58.52 96.62,57.61 BUS.7 | 88.09,60.35 86.26,60.35 BUS/DIP_0-3.14 | 88.09,60.35 88.09,65.38 87.33,66.14 87.33,69.19 86.41,70.1 86.41,76.96 RAM_OUT_0-7.15
B4  (via drill 0.35)
  Top 0.152: v63.55,61.57 63.55,62.03 60.96,64.62 60.35,64.62 60.05,64.31 58.37,64.31 57,62.94 56.69,62.94 BUS/DIP_4-7.2 | v70.26,63.09 74.68,63.09 75.13,63.55 75.74,63.55 76.81,62.48 76.81,62.18 77.72,61.27 78.94,61.27 79.1,61.11 80.62,61.11 v82.6,63.09 | RAM_OUT_0-7.14 88.7,76.96 86.72,74.98 86.72,74.37 87.63,73.46 87.63,68.89 88.7,67.82 v88.7,65.38 90.98,65.38 92.51,63.86 93.12,63.86 94.18,64.92 v94.18,65.68 | v97.54,67.06 98.15,66.45 98.15,56.84 BUS.9
  Bottom 0.152: v63.55,61.57 68.73,61.57 v70.26,63.09 | v82.6,63.09 85.04,63.09 86.41,64.47 87.78,64.47 v88.7,65.38 | v97.54,67.06 95.56,67.06 v94.18,65.68
B5  (via drill 0.35)
  Top 0.152: v63.25,55.93 61.42,55.93 60.81,55.32 56.69,55.32 BUS/DIP_4-7.5 | v73.46,56.24 76.05,56.24 77.88,54.41 78.64,54.41 v79.86,55.63 | v79.86,58.52 83.21,61.87 83.21,64.31 84.12,65.23 84.12,66.6 v84.28,66.75 | v90.07,69.04 90.07,75.74 91.29,76.96 RAM_OUT_0-7.13 | v94.18,74.22 95.4,74.22 95.71,73.91 95.71,73.3 95.4,73 95.4,72.39 98.6,69.19 98.6,55.02 97.08,53.49 96.77,53.49 BUS.11
  Bottom 0.152: v63.25,55.93 63.86,55.93 64.16,56.24 v73.46,56.24 | v79.86,58.52 v79.86,55.63 | v84.28,66.75 87.78,66.75 v90.07,69.04 | v94.18,74.22 91.44,76.96 RAM_OUT_0-7.13
B6  (via drill 0.35)
  Top 0.152: v69.34,39.78 72.85,39.78 78.03,34.59 91.29,34.59 97.84,41.15 97.84,46.48 v97.69,46.63
  Bottom 0.152: v69.34,39.78 68.12,41 68.12,43.74 68.73,44.35 68.73,49.99 67.82,50.9 67.21,50.9 65.38,52.73 64.62,52.73 BUS/DIP_4-7.11 | v97.69,46.63 97.69,46.94 97.84,47.09 97.84,50.29 96.77,51.36 BUS.13 96.77,51.51 98.91,53.65 98.91,71.32 94.03,76.2 94.03,76.96 RAM_OUT_0-7.12
B7  (via drill 0.35)
  Top 0.152: v69.8,57.61 68.89,57.61 | 68.89,57.61 68.73,57.61 65.99,60.35 64.62,60.35 BUS/DIP_4-7.14 | v96.01,72.69 96.01,76.66 96.32,76.96 RAM_OUT_0-7.11 | v73,38.71 77.42,34.29 91.44,34.29 98.3,41.15 98.3,47.24 96.77,48.77 96.77,49.38 BUS.15 | v71.63,44.65 69.04,44.65 66.6,47.09 66.6,55.32 68.89,57.61
  Bottom 0.152: v69.8,57.61 74.52,62.33 74.52,65.68 77.72,68.89 77.72,69.34 78.33,69.95 84.12,69.95 85.95,68.12 86.56,68.12 87.48,69.04 87.48,69.49 90.68,72.69 v96.01,72.69 | v73,38.71 73,40.08 73.15,40.23 73.15,43.13 v71.63,44.65
B8  (via drill 0.35)
  Top 0.152: v25.6,80.31 25.6,80.77 28.35,83.52 v46.18,83.52 | v84.43,57.91 84.43,58.22 84.73,58.52 84.73,65.84 85.19,66.29 v85.19,76.35 | v83.36,80.16 83.36,81.08 79.1,85.34 v65.99,85.34 | v58.06,86.56 55.63,86.56 v50.75,81.69
  Bottom 0.152: v25.6,80.31 25.15,80.31 22.25,77.42 22.25,74.22 21.95,73.91 21.03,73.91 14.78,67.67 13.56,67.67 13.26,67.97 13.26,69.34 12.34,70.26 10.06,70.26 2.44,77.88 1.68,77.88 1.22,77.42 1.22,76.2 9.3,68.12 9.91,68.12 11.89,66.14 11.89,64.77 11.12,64.01 11.12,62.94 BUS/DIP_8-11.2 | v46.18,83.52 47.7,83.52 50.14,81.08 | 50.14,81.08 50.6,80.62 50.6,77.11 RAM_OUT_8-15.18 | v84.43,57.91 85.34,57 87.48,57 93.88,63.4 94.18,63.4 BUS.2 | v85.19,76.35 85.19,78.33 v83.36,80.16 | v65.99,85.34 65.08,85.34 63.86,86.56 v58.06,86.56 | 50.14,81.08 v50.75,81.69
B9  (via drill 0.35)
  Top 0.152: v3.05,67.21 3.05,68.73 10.36,76.05 31.09,76.05 31.7,76.66 31.7,77.27 29.57,79.4 24.99,79.4 23.62,80.77 23.62,81.23 26.52,84.12 46.48,84.12 46.79,83.82 46.79,81.53 46.48,81.23 46.48,80.77 47.85,79.4 v51.21,79.4 | v92.96,60.5 92.96,60.96 89.92,64.01 v89.92,64.77 | v91.59,71.48 91.59,72.39 v90.68,73.3 | v87.33,74.68 v88.7,73.3 | v74.37,79.1 72.69,77.42 72.69,72.24 v72.85,72.08 | v55.47,70.41 v65.84,70.41
  Bottom 0.152: v3.05,67.21 5.33,64.92 5.33,64.01 5.64,63.7 5.64,62.64 5.03,62.03 4.42,62.03 3.66,61.27 3.66,60.66 4.27,60.05 8.08,60.05 8.69,59.44 8.69,58.37 10.97,56.08 BUS/DIP_8-11.5 | v51.21,79.4 51.21,79.1 53.19,77.11 RAM_OUT_8-15.17 53.34,76.96 53.95,76.35 53.95,71.93 v55.47,70.41 | v92.96,60.5 93.88,61.42 94.18,61.42 BUS.4 | v89.92,64.77 89.92,66.29 92.2,68.58 92.2,70.87 v91.59,71.48 | v88.7,73.3 v90.68,73.3 | v87.33,74.68 87.33,77.11 82.75,81.69 76.96,81.69 v74.37,79.1 | v72.85,72.08 72.39,72.08 70.26,69.95 67.97,69.95 67.82,69.8 66.45,69.8 v65.84,70.41
B10  (via drill 0.35)
  Top 0.152: v16.76,55.02 18.9,52.88 BUS/DIP_8-11.11 | v28.65,60.2 v21.18,60.2 | v37.95,82.6 42.52,82.6 44.04,81.08 44.04,80.62 45.87,78.79 53.95,78.79 55.63,77.11 RAM_OUT_8-15.16 | v91.44,64.01 91.44,62.94 94.18,60.2 94.18,59.59 BUS.6 | v97.38,79.25 v97.38,71.48 | v97.38,84.89 85.34,96.93 81.99,96.93 71.93,86.87 65.99,86.87 62.94,83.82 62.94,82.14 63.55,81.53 63.55,78.49 62.03,76.96 62.03,73.91 61.72,73.61 v58.37,73.61
  Bottom 0.152: v16.76,55.02 14.63,55.02 13.87,55.78 13.87,56.39 16.92,59.44 20.42,59.44 v21.18,60.2 | v28.65,60.2 29.11,60.2 31.55,62.64 32,62.64 32.61,63.25 32.61,66.45 30.94,68.12 30.33,68.12 28.04,70.41 26.21,70.41 25.91,70.71 25.91,73 27.28,74.37 27.28,77.27 32.61,82.6 v37.95,82.6 | v91.44,64.01 91.44,64.47 95.1,68.12 96.77,68.12 97.38,68.73 v97.38,71.48 | v97.38,84.89 v97.38,79.25 | v58.37,73.61 58.37,74.07 55.78,76.66 55.78,76.96 RAM_OUT_8-15.16
B11  (via drill 0.35)
  Top 0.152: v34.29,70.1 34.29,68.58 35.36,67.51 35.36,63.25 34.44,62.33 22.4,62.33 20.57,60.5 19.05,60.5 BUS/DIP_8-11.14 | v34.9,76.2 34.9,77.27 v36.58,78.94 | v49.99,78.18 53.19,78.18 55.32,76.05 57.3,76.05 58.22,76.96 RAM_OUT_8-15.15 | v95.1,73.61 95.1,68.58 97.84,65.84 97.84,57.15 97.23,56.54 96.32,56.54 95.4,57.45 94.34,57.45 BUS.8
  Bottom 0.152: v34.29,70.1 34.29,70.41 35.2,71.32 35.2,75.89 v34.9,76.2 | v36.58,78.94 41.6,78.94 43.74,81.08 43.74,81.53 44.5,82.3 48.46,82.3 49.99,80.77 v49.99,78.18 | v95.1,73.61 95.1,74.22 93.57,75.74 93.42,75.74 92.2,76.96 92.2,78.79 89.46,81.53 89.46,82.3 89.15,82.6 72.69,82.6 71.78,81.69 61.72,81.69 61.11,81.08 61.11,79.86 58.37,77.11 RAM_OUT_8-15.15
B12  (via drill 0.35)
  Top 0.152: v5.49,26.06 5.94,26.06 16.92,15.09 76.05,15.09 v81.23,20.27 | v90.98,43.74 v90.98,51.82 90.98,52.58 93.73,55.32 94.18,55.32 BUS.10 | v68.89,74.83 68.89,72.54 70.41,71.02 v70.41,68.43 | v70.56,61.87 72.39,61.87 78.03,56.24 80.16,56.24 84.58,51.82 v87.33,51.82
  Bottom 0.152: v5.49,26.06 5.49,34.29 2.59,37.19 2.59,38.56 BUS/DIP_12-15.2 | v81.23,20.27 89.61,20.27 91.59,22.25 92.35,22.25 92.96,22.86 92.96,28.5 90.98,30.48 v90.98,43.74 | v68.89,74.83 66.75,74.83 63.7,77.88 62.94,77.88 62.18,77.11 60.96,77.11 RAM_OUT_8-15.14 | v70.41,68.43 71.02,67.82 71.02,65.38 70.87,65.23 70.87,62.18 v70.56,61.87 | v90.98,51.82 v87.33,51.82
B13  (via drill 0.35)
  Top 0.152: v4.88,26.98 5.49,26.98 15.39,17.07 21.49,17.07 21.95,16.61 56.08,16.61 | 56.08,16.61 76.2,16.61 81.08,21.49 81.08,23.62 82.14,24.69 v82.14,29.57 | v85.5,35.2 92.66,42.37 92.66,51.82 94.18,53.34 BUS.12 | v58.22,65.23 v59.13,66.14 | v55.32,35.97 55.32,31.24 56.08,30.48 56.08,29.41 v57.3,28.19 | 56.08,16.61 v56.08,16.31
  Bottom 0.152: v4.88,26.98 4.88,27.28 2.59,29.57 2.59,30.94 BUS/DIP_12-15.5 | v82.14,29.57 85.5,32.92 v85.5,35.2 | v59.13,66.14 61.72,68.73 61.72,69.34 60.5,70.56 60.5,74.68 62.79,76.96 63.25,76.96 RAM_OUT_8-15.13 | v58.22,65.23 57.91,65.23 56.54,63.86 56.24,63.86 55.02,62.64 55.02,60.66 58.06,57.61 58.06,50.44 55.32,47.7 v55.32,35.97 | v57.3,28.19 57.3,24.84 56.08,23.62 v56.08,16.31
B14  (via drill 0.35)
  Top 0.152: v78.79,27.58 76.05,24.84 76.05,21.49 72.39,17.83 21.64,17.83 11.12,28.35 10.52,28.35 BUS/DIP_12-15.11 | v89.46,35.51 94.49,40.54 94.64,40.54 95.25,41.15 95.25,50.44 94.34,51.36 BUS.14 | v65.23,83.21 65.23,82.45 65.84,81.84 65.84,77.11 RAM_OUT_8-15.12 | v60.66,83.97 55.32,83.97 v55.02,83.67 | v39.01,80.16 39.01,77.57 39.32,77.27 v39.32,74.22 | v38.41,66.14 38.1,66.14 37.19,65.23 37.19,59.59 v36.42,58.83 | v36.42,55.32 36.42,54.1 33.07,50.75 v33.07,50.14 | v36.73,38.41 v34.9,40.23
  Bottom 0.152: v78.79,27.58 81.08,27.58 81.23,27.43 84.89,27.43 89.46,32 v89.46,35.51 | v65.23,83.21 64.62,83.21 63.86,83.97 v60.66,83.97 | v55.02,83.67 48.01,83.67 47.55,84.12 44.2,84.12 40.23,80.16 v39.01,80.16 | v39.32,74.22 39.32,67.06 v38.41,66.14 | v36.42,55.32 v36.42,58.83 | v33.07,50.14 33.07,48.62 33.53,48.16 33.53,44.35 34.44,43.43 34.44,40.69 v34.9,40.23 | v36.73,38.41 36.42,38.41 36.12,38.71 30.33,38.71 26.52,34.9 18.9,34.9 12.5,28.5 10.52,28.5 BUS/DIP_12-15.11
B15  (via drill 0.35)
  Top 0.152: v6.71,31.55 10.36,35.2 10.36,35.97 BUS/DIP_12-15.14 | v8.69,28.96 18.14,19.51 19.51,19.51 22.1,16.92 73.91,16.92 81.53,24.54 v81.53,28.04 v77.88,31.7 | v86.41,35.2 86.41,35.66 92.96,42.22 92.96,48.16 94.18,49.38 BUS.16 | v81.23,80.62 78.33,83.52 71.32,83.52 71.02,83.21 71.02,80.31 68.58,77.88 68.58,77.11 RAM_OUT_8-15.11 | v85.8,71.17 v85.8,73.46 | v83.97,70.56 82.3,68.89 v82.3,64.77 | v83.82,63.7 83.82,59.44 v81.08,56.69
  Bottom 0.152: v6.71,31.55 6.71,30.94 v8.69,28.96 | v81.53,28.04 86.41,32.92 v86.41,35.2 | v81.23,80.62 83.97,77.88 84.12,77.88 84.58,77.42 84.58,74.68 v85.8,73.46 | v85.8,71.17 84.58,71.17 v83.97,70.56 | v82.3,64.77 82.75,64.77 v83.82,63.7 | v81.08,56.69 81.08,43.43 74.83,37.19 74.83,34.14 77.27,31.7 v77.88,31.7
BRD0
  Top 0.152: BUS/DIP_0-3.4 78.18,57.91 78.18,58.67 74.37,62.48 67.67,62.48 ARD/BRD_0-3.2
BRD1
  Top 0.152: BUS/DIP_0-3.7 78.18,50.29 78.18,51.05 74.52,54.71 67.82,54.71 67.67,54.86 ARD/BRD_0-3.5
BRD2
  Top 0.152: BUS/DIP_0-3.9 86.11,47.55 79.7,47.55 75.59,51.66 75.59,52.43 ARD/BRD_0-3.11
BRD3
  Top 0.152: BUS/DIP_0-3.12 86.11,55.32 81.53,55.32 79.86,57 77.88,57 75.59,59.28 75.59,60.05 ARD/BRD_0-3.14
BRD4
  Top 0.152: BUS/DIP_4-7.4 56.54,57.91 55.17,57.91 53.19,59.89 50.14,59.89 46.33,63.7 45.26,63.7 ARD/BRD_4-7.2
BRD5
  Top 0.152: BUS/DIP_4-7.7 56.54,50.14 51.82,50.14 45.87,56.08 45.26,56.08 ARD/BRD_4-7.5
BRD6
  Top 0.152: BUS/DIP_4-7.9 64.47,47.55 60.66,47.55 56.39,51.82 54.86,51.82 53.19,53.49 ARD/BRD_4-7.11
BRD7  (via drill 0.35)
  Top 0.152: v58.98,59.44 56.24,59.44 54.56,61.11 53.19,61.11 ARD/BRD_4-7.14 | v60.5,57.91 62.18,57.91 64.47,55.63 64.47,55.32 BUS/DIP_4-7.12
  Bottom 0.152: v60.5,57.91 v58.98,59.44
BRD8
  Top 0.152: BUS/DIP_8-11.4 11.12,57.91 11.12,58.37 16.76,64.01 22.86,64.01 23.32,64.47 27.58,64.47 29.41,62.64 33.53,62.64 34.44,63.55 ARD/BRD_8-11.2
BRD9
  Top 0.152: BUS/DIP_8-11.7 10.97,50.14 10.36,50.14 9.45,49.23 9.45,48.62 9.75,48.31 10.36,48.31 10.67,48.62 21.18,48.62 22.55,49.99 32,49.99 32.77,50.75 32.77,54.25 34.44,55.93 ARD/BRD_8-11.5
BRD10
  Top 0.152: BUS/DIP_8-11.9 19.05,47.7 20.73,47.7 22.55,49.53 34.9,49.53 38.71,53.34 42.37,53.34 ARD/BRD_8-11.11
BRD11
  Bottom 0.152: BUS/DIP_8-11.12 19.05,55.32 21.79,55.32 23.77,57.3 32.16,57.3 33.07,58.22 33.07,58.83 33.98,59.74 37.03,59.74 37.95,58.83 40.23,58.83 42.37,60.96 ARD/BRD_8-11.14
BRD12  (via drill 0.35)
  Top 0.152: v6.55,57.91 9.75,57.91 10.97,59.13 11.43,59.13 15.54,63.25 v15.54,63.7
  Bottom 0.152: v6.55,57.91 1.68,57.91 1.22,57.45 1.22,36.12 2.44,34.9 2.44,33.68 BUS/DIP_12-15.4 | v15.54,63.7 18.44,63.7 18.59,63.86 23.47,63.86 23.62,63.7 ARD/BRD_12-15.2
BRD13  (via drill 0.35)
  Top 0.152: v25.15,46.18 24.23,45.26 17.68,45.26 16,43.59 11.58,43.59 8.23,40.23 2.74,40.23 1.22,38.71 1.22,28.04 2.44,26.82 2.44,26.06 BUS/DIP_12-15.7 | v26.98,50.9 24.99,52.88 24.99,54.71 23.77,55.93 ARD/BRD_12-15.5
  Bottom 0.152: v25.15,46.18 25.15,49.07 v26.98,50.9
BRD14  (via drill 0.35)
  Top 0.152: v26.52,45.72 22.86,42.06 17.53,42.06 15.39,39.93 5.03,39.93 1.52,36.42 1.52,28.19 2.13,27.58 5.33,27.58 9.45,23.47 10.36,23.47 BUS/DIP_12-15.9 | v29.26,51.05 31.55,53.34 ARD/BRD_12-15.11
  Bottom 0.152: v26.52,45.72 26.52,48.31 v29.26,51.05
BRD15
  Bottom 0.152: BUS/DIP_12-15.12 10.52,31.09 12.5,31.09 17.37,35.97 27.13,35.97 30.18,39.01 37.95,39.01 42.06,34.9 42.06,34.75 44.04,32.77 46.02,32.77 46.79,33.53 46.79,46.02 49.07,48.31 49.07,58.52 47.85,59.74 45.11,59.74 42.82,62.03 40.39,62.03 39.62,61.27 35.51,61.27 34.75,62.03 32.61,62.03 31.7,61.11 ARD/BRD_12-15.14
CLK  (via drill 0.35)
  Top 0.152: v95.1,36.58 98.3,33.38 98.3,18.75 81.99,2.44 46.63,2.44 38.1,10.97 17.98,10.97 AND_GATE.4
  Bottom 0.152: v95.1,36.58 95.1,41 95.71,41.6 95.71,42.52 96.62,43.43 BUS.21
DIP0
  Bottom 0.152: BUS/DIP_0-3.3 78.33,60.35 78.33,59.13 79.25,58.22 79.25,53.95 79.86,53.34 79.86,43.59 71.63,35.36 DIP_0-7.9
DIP1
  Bottom 0.152: BUS/DIP_0-3.6 78.18,52.73 76.96,52.73 70.26,46.02 70.26,36.42 69.19,35.36 DIP_0-7.10
DIP2  (via drill 0.35)
  Top 0.152: v83.06,46.63 80.01,46.63 v73.76,40.39
  Bottom 0.152: v83.06,46.63 83.06,47.09 86.11,50.14 BUS/DIP_0-3.10 | v73.76,40.39 73.76,38.56 71.48,36.27 71.17,36.27 70.56,35.66 70.56,35.05 69.49,33.98 67.82,33.98 66.6,35.2 DIP_0-7.11
DIP3
  Top 0.152: BUS/DIP_0-3.13 86.26,57.76 86.26,57 88.54,54.71 88.54,48.77 86.56,46.79 83.82,46.79 83.36,47.24 79.1,47.24 73,41.15 69.8,41.15 64.01,35.36 DIP_0-7.12
DIP4
  Bottom 0.152: BUS/DIP_4-7.3 56.69,60.35 56.69,59.44 60.81,55.32 60.81,54.41 64.01,51.21 64.77,51.21 65.38,50.6 65.38,44.04 64.92,43.59 64.92,38.71 61.57,35.36 DIP_0-7.13
DIP5
  Bottom 0.152: BUS/DIP_4-7.6 56.54,52.73 56.54,51.51 55.02,49.99 55.02,36.58 54.71,36.27 54.71,35.66 56.08,34.29 57.91,34.29 58.83,35.2 DIP_0-7.14
DIP6
  Bottom 0.152: BUS/DIP_4-7.10 64.47,50.14 62.48,50.14 57.3,44.96 57.3,36.27 56.39,35.36 DIP_0-7.15
DIP7
  Top 0.152: BUS/DIP_4-7.13 64.62,57.76 64.62,57 65.99,55.63 65.99,44.2 65.23,43.43 65.23,42.82 64.16,41.76 63.55,41.76 59.28,37.49 55.93,37.49 53.8,35.36 DIP_0-7.16
DIP8  (via drill 0.35)
  Top 0.152: v13.56,54.71 13.56,51.82 v15.85,49.53 | v27.74,37.64 34.44,37.64 v35.51,36.58 | v41.91,33.98 46.79,33.98 48.01,35.2 DIP_8-15.9
  Bottom 0.152: v13.56,54.71 13.56,56.54 11.12,58.98 11.12,60.35 BUS/DIP_8-11.3 | v27.74,37.64 v15.85,49.53 | v35.51,36.58 37.8,36.58 40.39,33.98 v41.91,33.98
DIP9  (via drill 0.35)
  Top 0.152: v40.08,56.69 40.54,56.69 42.52,54.71 42.98,54.71 44.04,53.65 v44.04,46.02
  Bottom 0.152: v40.08,56.69 39.01,56.69 38.71,56.39 38.71,55.93 37.49,54.71 34.44,54.71 32.31,52.58 21.34,52.58 20.57,51.82 18.59,51.82 17.68,52.73 11.12,52.73 BUS/DIP_8-11.6 | v44.04,46.02 44.04,44.04 44.5,43.59 44.5,36.27 45.41,35.36 DIP_8-15.10
DIP10
  Bottom 0.152: BUS/DIP_8-11.10 19.05,50.14 19.05,48.77 23.62,44.2 23.62,44.04 28.35,39.32 38.86,39.32 42.82,35.36 DIP_8-15.11
DIP11
  Top 0.152: BUS/DIP_8-11.13 19.05,57.76 23.16,57.76 23.62,57.3 37.19,57.3 40.08,54.41 42.82,54.41 43.43,53.8 43.43,47.4 41.6,45.57 41.6,37.95 40.54,36.88 40.54,35.36 DIP_8-15.12
DIP12
  Top 0.152: BUS/DIP_12-15.3 2.59,36.12 9.14,36.12 11.28,38.25 34.75,38.25 37.8,35.2 DIP_8-15.13
DIP13
  Top 0.152: BUS/DIP_12-15.6 2.59,28.5 4.57,28.5 8.69,32.61 11.28,32.61 11.89,33.22 15.7,33.22 16.15,32.77 32.77,32.77 35.2,35.2 DIP_8-15.14
DIP14
  Bottom 0.152: BUS/DIP_12-15.10 10.52,26.06 23.62,26.06 32.77,35.2 DIP_8-15.15
DIP15
  Top 0.152: BUS/DIP_12-15.13 10.52,33.53 15.85,33.53 16.31,33.07 28.04,33.07 30.18,35.2 DIP_8-15.16
GND  (via drill 0.35)  (7 unrouted)
  Top 0.152: BUS/DIP_4-7.15 64.62,62.94 64.62,63.4 66.6,65.38 66.6,65.84 68.43,67.67 68.43,68.89 RAM_OUT_8-15.10 | 53.19,63.7 54.56,63.7 56.24,62.03 57.91,62.03 59.13,63.25 59.13,63.4 59.44,63.7 60.05,63.7 62.33,61.42 | 33.22,69.04 ARDUINO_WRITE.5 | ARDUINO_WRITE.8 40.84,68.89 39.47,68.89 38.71,68.12 36.58,68.12 35.81,68.89 ARDUINO_WRITE.6 | MEMORY_0-7.2 56.84,80.92 55.93,80.92 55.17,81.69 51.66,81.69 51.05,81.08 47.55,81.08 MEMORY_8-15.14 47.4,81.08 47.4,83.67 46.63,84.43 26.36,84.43 23.32,81.38 23.32,80.16 | ARDUINO_WRITE.11 38.25,76.96 ARDUINO_WRITE.10 | ARDUINO_WRITE.13 30.63,76.96 ARDUINO_WRITE.14 28.04,76.96 25.76,76.96 ARDUINO_WRITE.15 25.6,77.11 23.32,79.4 23.32,80.16 | 62.33,61.42 62.33,60.96 57.76,56.39 54.1,56.39 53.49,57 47.24,57 | 47.24,57 45.57,57 43.74,58.83 43.74,62.33 42.52,63.55 | 62.33,61.42 v62.64,61.42 | v77.11,91.14 87.33,80.92 MEMORY_0-7.14 | BOARD_WRITE.15 4.72,76.96 7.16,76.96 BOARD_WRITE.14 7.32,76.96 9.6,76.96 BOARD_WRITE.13 9.75,77.11 11.12,77.11 11.89,77.88 14.02,77.88 14.78,77.11 BOARD_WRITE.11 14.94,76.96 17.22,76.96 BOARD_WRITE.10 17.22,77.11 17.07,77.27 17.07,80.92 MEMORY_8-15.2 17.07,81.08 18.29,81.08 19.51,82.3 | BOARD_WRITE.5 12.34,69.04 14.78,69.04 BOARD_WRITE.6 14.94,68.89 14.94,68.12 | 14.94,68.12 v14.94,66.75 | 14.94,68.12 17.68,68.12 18.44,68.89 19.81,68.89 BOARD_WRITE.8 | 19.51,82.3 33.38,96.16 34.75,96.16 MEMORY_8-15.20 | 23.32,80.16 21.64,80.16 19.51,82.3 | C1.1 19.36,34.14 19.36,36.88 C2.1 | BUS/DIP_12-15.15 10.52,38.71 17.98,38.71 19.2,39.93 C3.1 | v36.88,49.53 35.66,49.53 34.59,48.46 ARD/BRD_8-11.8 34.44,48.46 33.68,49.23 31.24,49.23 30.48,48.46 23.77,48.46 ARD/BRD_12-15.8 23.62,48.31 21.79,48.31 20.27,46.79 18.59,46.79 17.83,47.55 11.12,47.55 BUS/DIP_8-11.8
  Top 0.152: v47.24,53.8 51.51,49.53 51.51,48.92 52.88,47.55 56.54,47.55 BUS/DIP_4-7.8 | 75.59,62.48 75.59,61.87 78.03,59.44 79.86,59.44 v82.6,62.18 | 73.91,47.24 67.67,47.24 ARD/BRD_0-3.8 | v77.72,42.52 82.75,37.49 85.95,37.49 86.87,38.41 S1.A3 | 73.91,47.24 v73.91,50.6 | 73.91,47.24 v74.22,47.24 | LED0.K 96.93,18.75 92.05,18.75 LED1.K 91.9,18.75 87.94,18.75 | LED5.K 71.93,18.75 67.06,18.75 LED6.K 66.9,18.75 62.03,18.75 LED7.K 61.87,18.75 57.15,18.75 LED8.K 57,18.75 52.12,18.75 LED9.K 51.97,18.75 47.09,18.75 LED10.K 46.94,18.75 42.06,18.75 LED11.K 41.91,18.75 37.03,18.75 LED12.K 36.88,18.75 32,18.75 LED13.K 31.85,18.75 27.13,18.75 LED14.K 26.98,18.75 22.1,18.75 LED15.K | 87.94,18.75 87.02,18.75 LED2.K | AND_GATE.13 10.06,5.94 10.06,8.38 AND_GATE.12 9.91,8.53 9.91,9.91 9.14,10.67 9.14,12.65 9.91,13.41 AND_GATE.10 10.06,13.56 10.06,16 AND_GATE.9 9.91,16 2.59,23.32 BUS/DIP_12-15.8 | v87.02,32.16 87.94,31.24 87.94,18.75 | v47.24,55.63 47.24,57
  Bottom 0.152: v62.64,61.42 62.94,61.72 62.94,61.87 63.86,62.79 64.47,62.79 BUS/DIP_4-7.15 | 42.37,63.7 42.37,64.47 41,65.84 41,68.89 ARDUINO_WRITE.8 | ARDUINO_WRITE.5 33.38,69.04 35.66,69.04 ARDUINO_WRITE.6 ARDUINO_WRITE.11 35.66,77.11 34.44,77.11 33.68,77.88 31.55,77.88 30.79,77.11 ARDUINO_WRITE.13 | v77.11,91.14 77.11,93.73 74.83,96.01 MEMORY_0-7.20 | 9.75,77.11 BOARD_WRITE.13 | v14.94,66.75 14.94,63.4 15.24,63.09 16.46,63.09 16.61,62.94 18.9,62.94 BUS/DIP_8-11.15 | BOARD_WRITE.6 14.94,69.04 14.94,76.96 BOARD_WRITE.11 | BUS/DIP_8-11.8 10.97,47.55 10.97,41.91 11.28,41.6 11.28,39.47 10.52,38.71 BUS/DIP_12-15.15 | C4.1 19.36,42.98 19.36,40.08 C3.1 19.36,39.93 19.36,37.03 C2.1 | 42.52,49.53 43.43,48.62 45.11,48.62 ARD/BRD_4-7.8 | v36.88,49.53 42.52,49.53 | 42.52,49.53 44.96,51.97 45.41,51.97 v47.24,53.8 v47.24,55.63 | v82.6,62.18 85.5,62.18 86.11,62.79 BUS/DIP_0-3.15 86.26,62.94 89,62.94 94.94,68.89 96.32,68.89 RAM_OUT_0-7.10 | v74.22,47.24 74.98,46.48 77.11,46.48 | 77.11,46.48 78.18,47.55 BUS/DIP_0-3.8 | BUS.20 94.18,45.41 91.75,45.41 87.02,40.69 87.02,38.56 S1.A3 87.02,38.41 v87.02,32.16 | 77.11,46.48 77.11,43.13 v77.72,42.52 | 75.44,62.48 75.44,61.27 74.52,60.35 74.52,59.74 74.68,59.59 74.68,58.06 74.37,57.76 74.37,55.63 73.91,55.17 v73.91,50.6 | LED2.K 86.87,18.75 82.14,18.75 LED3.K 81.99,18.75 77.11,18.75 LED4.K 76.96,18.75 72.08,18.75 LED5.K | LED15.K 21.95,18.59 17.98,18.59 AND_GATE.7 17.83,18.59 15.39,16.15 10.06,16.15 AND_GATE.9 9.91,16.15 9.14,16.92 9.14,25.91 10.06,26.82 11.28,26.82 18.44,33.98 19.2,33.98 C1.1
N$1
  Bottom 0.152: LED1.A 92.05,21.34 93.27,22.55 93.27,29.57 92.05,30.79 R1.1
N$2  (via drill 0.35)
  Top 0.152: v3.05,59.89 3.05,59.44 3.35,59.13 3.35,52.88 4.27,51.97 5.03,51.97 v11.58,45.41 | v12.19,31.7 19.81,24.08 21.34,24.08 v22.4,25.15 | v38.1,19.36 41.3,19.36 41.6,19.66 65.53,19.66 v65.84,19.36 | v73.61,22.71 73.61,23.77 v78.33,28.5
  Bottom 0.152: v3.05,59.89 1.98,59.89 1.22,60.66 1.22,69.8 1.37,69.95 5.03,69.95 5.94,69.04 7.16,69.04 BOARD_WRITE.3 | v11.58,45.41 11.58,32.31 v12.19,31.7 | v22.4,25.15 26.82,25.15 32.31,19.66 37.8,19.66 v38.1,19.36 | v65.84,19.36 66.29,19.36 67.21,20.27 69.65,20.27 71.63,22.25 73.15,22.25 v73.61,22.71 | v78.33,28.5 81.69,31.85 83.52,31.85 84.89,33.22 84.89,38.41 S1.A2
N$3
  Top 0.152: BOARD_WRITE.4 9.75,69.04 10.97,69.04 11.89,69.95 20.57,69.95 22.4,68.12 24.84,68.12 25.6,68.89 ARDUINO_WRITE.2
N$4
  Top 0.152: LED2.A 86.87,21.34 86.87,21.95 86.11,22.71 86.11,30.02 86.87,30.79 R2.1
N$5
  Top 0.152: LED3.A 82.14,21.34 82.14,21.95 82.91,22.71 82.91,30.02 82.14,30.79 R3.1
N$6
  Top 0.152: LED4.A 77.11,21.34 77.11,21.95 79.4,24.23 79.4,28.5 77.11,30.79 R4.1
N$7
  Top 0.152: LED5.A 72.08,21.34 72.08,21.95 73,22.86 73,29.87 72.08,30.79 R5.1
N$8
  Top 0.152: LED6.A 67.06,21.34 67.06,21.95 67.97,22.86 67.97,29.87 67.06,30.79 R6.1
N$9
  Top 0.152: LED7.A 62.03,21.34 62.03,21.95 62.94,22.86 62.94,29.87 62.03,30.79 R7.1
N$10
  Top 0.152: LED8.A 57.15,21.34 57.15,21.95 59.13,23.93 59.13,28.8 57.15,30.79 R8.1
N$11
  Top 0.152: LED9.A 52.12,21.34 52.12,21.95 53.03,22.86 53.03,29.87 52.12,30.79 R9.1
N$12
  Top 0.152: LED10.A 47.09,21.34 47.09,21.95 48.01,22.86 48.01,29.87 47.09,30.79 R10.1
N$13
  Top 0.152: LED11.A 42.06,21.34 42.06,21.95 42.98,22.86 42.98,29.87 42.06,30.79 R11.1
N$14
  Top 0.152: LED12.A 37.03,21.34 37.03,21.95 37.95,22.86 37.95,29.87 37.03,30.79 R12.1
N$15
  Top 0.152: LED13.A 31.85,21.34 31.85,21.95 31.09,22.71 31.09,30.02 31.85,30.79 R13.1
N$16
  Top 0.152: LED14.A 27.13,21.34 27.13,21.95 27.89,22.71 27.89,30.02 27.13,30.79 R14.1
N$17
  Top 0.152: LED15.A 22.1,21.34 22.1,21.95 23.01,22.86 23.01,29.87 22.1,30.79 R15.1
N$18
  Top 0.152: LED0.A 97.08,21.34 97.08,21.95 97.99,22.86 97.99,29.87 97.08,30.79 R0.1
PRGM  (via drill 0.35)
  Top 0.152: v71.63,68.73 v70.41,67.51 | v76.35,70.26 77.72,68.89 77.72,65.99 78.18,65.53 BUS/DIP_0-3.1 | v26.52,71.02 26.52,68.58 25.76,67.82 19.96,67.82 17.68,65.53 11.12,65.53 BUS/DIP_8-11.1 | v41.3,79.55 45.87,74.98 v48.46,74.98 | v6.25,45.41 2.59,41.76 2.59,41.3 BUS/DIP_12-15.1 | v8.99,50.75 8.99,52.73 9.45,53.19 v9.45,56.08 | v8.08,62.48 v8.08,59.13
  Bottom 0.152: 17.83,4.12 17.83,3.5 AND_GATE.1 | 17.83,4.12 17.83,4.42 6.1,16.15 6.1,36.27 2.59,39.78 2.59,41.15 BUS/DIP_12-15.1 | 17.83,4.12 48.92,4.12 MAR.7 | 8.08,62.94 7.92,62.94 6.71,64.16 6.71,64.47 2.13,69.04 BOARD_WRITE.1 | 8.08,62.94 8.53,62.94 10.97,65.38 BUS/DIP_8-11.1 | 56.84,65.53 57.61,65.53 57.91,65.84 58.52,65.84 59.13,65.23 59.13,62.79 59.44,62.48 60.2,62.48 65.23,67.51 v70.41,67.51 | 56.84,65.53 56.69,65.53 BUS/DIP_4-7.1 56.84,65.53 | v71.63,68.73 73.15,70.26 v76.35,70.26 | v26.52,71.02 26.52,73.15 29.26,75.89 29.26,77.72 31.09,79.55 v41.3,79.55 | v48.46,74.98 54.56,68.89 54.56,67.82 56.84,65.53 | v6.25,45.41 6.25,48.01 v8.99,50.75 | v9.45,56.08 9.45,57.15 8.08,58.52 v8.08,59.13 | 8.08,62.94 v8.08,62.48
RAM0  (via drill 0.35)
  Top 0.152: v77.72,70.87 77.72,77.27 79.7,79.25 79.7,80.77 MEMORY_0-7.11 | v90.07,30.18 96.93,23.32 R0.2 | v90.07,42.82 86.72,46.18 v86.41,46.18 | v85.04,48.16 84.12,48.16 78.18,54.1 77.57,54.1 75.74,55.93 74.07,55.93 73.76,55.63 73.15,55.63 70.26,58.52 v70.26,58.98
  Bottom 0.152: v77.72,70.87 77.72,70.56 76.2,69.04 RAM_OUT_0-7.2 76.05,68.89 76.05,67.67 74.22,65.84 74.22,62.48 72.39,60.66 71.93,60.66 v70.26,58.98 68.89,57.61 67.67,57.61 ARD/BRD_0-3.4 | v90.07,42.82 v90.07,30.18 | v86.41,46.18 85.04,47.55 v85.04,48.16
RAM1  (via drill 0.35)
  Top 0.152: MEMORY_0-7.12 82.3,80.77 79.55,78.03 79.55,69.8 78.79,69.04 RAM_OUT_0-7.3 78.64,69.04 76.81,70.87 76.05,70.87 75.13,69.95 75.13,68.28 v75.44,67.97 | v68.43,51.21 68.43,50.75 67.67,49.99 ARD/BRD_0-3.7
  Bottom 0.152: ARD/BRD_0-3.7 67.67,49.84 67.67,48.46 68.43,47.7 68.43,44.5 67.51,43.59 67.51,38.1 65.23,35.81 65.23,34.75 68.43,31.55 69.95,31.55 79.25,22.25 90.98,22.25 91.9,23.16 R1.2 | v75.44,67.97 74.52,67.97 71.48,64.92 71.48,61.42 68.58,58.52 66.45,58.52 64.47,56.54 62.94,56.54 62.64,56.24 62.64,55.63 64.31,53.95 67.36,53.95 68.43,52.88 v68.43,51.21
RAM2  (via drill 0.35)
  Top 0.152: MEMORY_0-7.13 84.89,80.77 84.89,79.86 82.45,77.42 82.45,70.26 81.23,69.04 RAM_OUT_0-7.4 | v81.53,39.62 81.53,42.67 v79.25,44.96
  Bottom 0.152: 78.33,49.07 79.55,50.29 79.55,53.19 78.33,54.41 77.88,54.41 77.11,55.17 77.11,67.21 78.03,68.12 80.31,68.12 81.08,68.89 RAM_OUT_0-7.4 | 78.33,49.07 76.66,47.4 75.59,47.4 ARD/BRD_0-3.9 | v81.53,39.62 81.53,33.98 77.72,30.18 77.72,27.74 78.49,26.98 79.55,26.98 83.21,23.32 86.87,23.32 R2.2 | v79.25,44.96 79.25,48.16 78.33,49.07
RAM3  (via drill 0.35)
  Top 0.152: v93.42,79.7 93.42,78.94 94.79,77.57 94.79,75.74 93.12,74.07 93.12,72.39 v93.42,72.08 | ARD/BRD_0-3.12 75.44,55.02 73.3,55.02 68.43,59.89 68.43,60.5 66.6,62.33 66.6,62.94 67.51,63.86 75.89,63.86 77.11,62.64 77.11,62.33 77.88,61.57 79.1,61.57 79.25,61.42 79.86,61.42 83.67,65.23 83.67,68.89 RAM_OUT_0-7.5
  Bottom 0.152: v93.42,79.7 85.8,87.33 85.8,97.08 86.11,97.38 86.72,97.38 87.33,96.77 87.33,96.16 MEMORY_0-7.15 | v93.42,72.08 90.53,72.08 87.78,69.34 87.78,68.89 86.72,67.82 84.89,67.82 83.82,68.89 RAM_OUT_0-7.5 | R3.2 81.99,23.32 80.77,23.32 70.41,33.68 66.75,33.68 65.53,34.9 65.53,35.66 66.14,36.27 66.9,36.27 68.12,35.05 68.12,34.9 68.73,34.29 69.34,34.29 70.26,35.2 70.26,35.97 70.56,36.27 70.56,44.5 74.98,48.92 75.74,48.92 79.25,52.43 79.25,53.03 78.18,54.1 76.35,54.1 75.59,54.86 ARD/BRD_0-3.12
RAM4  (via drill 0.35)
  Top 0.152: v89.61,80.31 85.04,84.89 85.04,96.01 MEMORY_0-7.16 | v48.01,60.66 48.16,60.5 48.16,58.67 46.79,57.3 46.18,57.3 45.26,58.22 45.26,58.52 ARD/BRD_4-7.4 | v49.84,65.99 49.84,66.9 51.97,69.04 51.97,69.95 54.56,72.54 55.78,72.54 57.3,71.02 v69.04,71.02 | v64.01,28.8 v66.29,28.8 | v52.12,44.96 51.51,44.35 50.9,44.35 50.29,44.96 50.29,48.92 v47.85,51.36
  Bottom 0.152: v89.61,80.31 89.61,79.86 87.94,78.18 87.94,73 88.09,72.85 | 88.09,72.85 88.85,72.08 88.85,71.48 86.41,69.04 RAM_OUT_0-7.6 | v48.01,60.66 48.01,64.16 v49.84,65.99 | v69.04,71.02 70.87,71.02 72.69,72.85 88.09,72.85 | v66.29,28.8 67.67,28.8 73.15,23.32 76.96,23.32 R4.2 | v64.01,28.8 54.56,28.8 53.03,30.33 53.03,34.75 52.12,35.66 v52.12,44.96 | v47.85,51.36 47.85,57.45 46.79,58.52 45.26,58.52 ARD/BRD_4-7.4
RAM5  (via drill 0.35)
  Top 0.152: 89.76,71.78 89.76,69.95 88.85,69.04 RAM_OUT_0-7.7 | 89.76,71.78 89.76,78.18 89,78.94 89,80.47 82.45,87.02 82.45,96.01 MEMORY_0-7.17 | v46.18,39.93 55.78,30.33 55.78,28.8 v58.52,26.06 | v88.24,71.78 89.76,71.78 | v58.67,52.27 v61.72,55.32 | v55.93,45.72 53.8,45.72 52.12,44.04 50.6,44.04 46.18,48.46 46.18,49.99 45.26,50.9 ARD/BRD_4-7.7
  Bottom 0.152: v46.18,39.93 46.48,40.23 46.48,48.46 45.26,49.68 45.26,50.9 ARD/BRD_4-7.7 | v58.52,26.06 62.79,26.06 66.6,22.25 71.02,22.25 71.93,23.16 R5.2 | v88.24,71.78 73.76,71.78 71.02,69.04 71.02,68.28 71.32,67.97 71.32,65.23 71.17,65.08 71.17,61.57 68.43,58.83 64.16,58.83 61.72,56.39 v61.72,55.32 | v58.67,52.27 58.67,48.46 v55.93,45.72
RAM6  (via drill 0.35)
  Top 0.152: v93.57,81.38 91.9,79.7 91.9,77.72 92.2,77.42 92.2,69.8 91.44,69.04 RAM_OUT_0-7.8 | v63.25,46.02 61.72,46.02 59.13,48.62 53.19,48.62 ARD/BRD_4-7.9 | v87.48,65.08 87.48,62.94 85.34,60.81 85.34,57.45 87.94,54.86 v87.94,49.07 | v75.44,34.44 72.08,34.44 69.34,31.7 66.6,31.7 65.99,31.09 65.99,30.02 66.9,29.11 66.9,23.32 R6.2
  Bottom 0.152: v93.57,81.38 93.57,91.14 87.02,97.69 82.75,97.69 81.23,96.16 79.86,96.16 MEMORY_0-7.18 | v63.25,46.02 63.25,44.04 62.94,43.74 62.94,38.1 60.5,35.66 60.5,33.68 66.9,27.28 66.9,23.32 R6.2 | v87.48,65.08 91.29,68.89 RAM_OUT_0-7.8 | v87.94,49.07 87.94,43.13 86.72,41.91 82.91,41.91 v75.44,34.44
RAM7  (via drill 0.35)
  Top 0.152: v61.42,44.65 62.79,44.65 65.38,47.24 65.38,48.16 64.77,48.77 61.27,48.77 58.06,51.97 58.06,52.58 54.56,56.08 53.19,56.08 ARD/BRD_4-7.12 | v59.28,36.58 59.28,36.27 60.5,35.05 60.5,24.69 61.87,23.32 R7.2 | v86.41,96.77 85.95,97.23 79.86,97.23 78.79,96.16 77.42,96.16 MEMORY_0-7.19 | v93.12,78.33 93.12,77.42 92.81,77.11 92.81,70.1 93.88,69.04 RAM_OUT_0-7.9 | v52.27,67.82 52.27,69.34 v54.86,71.93
  Bottom 0.152: v61.42,44.65 59.28,42.52 v59.28,36.58 | v86.41,96.77 86.41,87.63 94.03,80.01 94.03,79.25 v93.12,78.33 | v52.27,67.82 52.88,67.21 53.49,67.21 54.1,66.6 54.1,58.37 53.19,57.45 53.19,56.24 ARD/BRD_4-7.12 | v54.86,71.93 54.86,77.42 57.3,79.86 59.89,79.86 60.81,80.77 60.81,81.23 61.87,82.3 71.93,82.3 72.24,82.6 72.24,84.43 73.15,85.34 85.95,85.34 86.26,85.65 86.26,86.41 77.42,95.25 77.42,96.01 MEMORY_0-7.19
RAM8  (via drill 0.35)
  Top 0.152: MEMORY_8-15.11 39.93,80.92 39.93,79.25 48.01,71.17 48.01,69.04 RAM_OUT_8-15.2 | v46.48,65.68 46.18,65.38 44.5,65.38 42.82,67.06 38.41,67.06 36.88,65.53 36.88,62.18 34.59,59.89 34.59,58.67 ARD/BRD_8-11.4 | v43.28,38.25 46.94,38.25 54.71,30.48 54.71,28.04 57,25.76 57,23.32 R8.2 | v36.73,52.27 36.73,52.73 37.95,53.95 37.95,55.78 37.03,56.69 v35.81,56.69